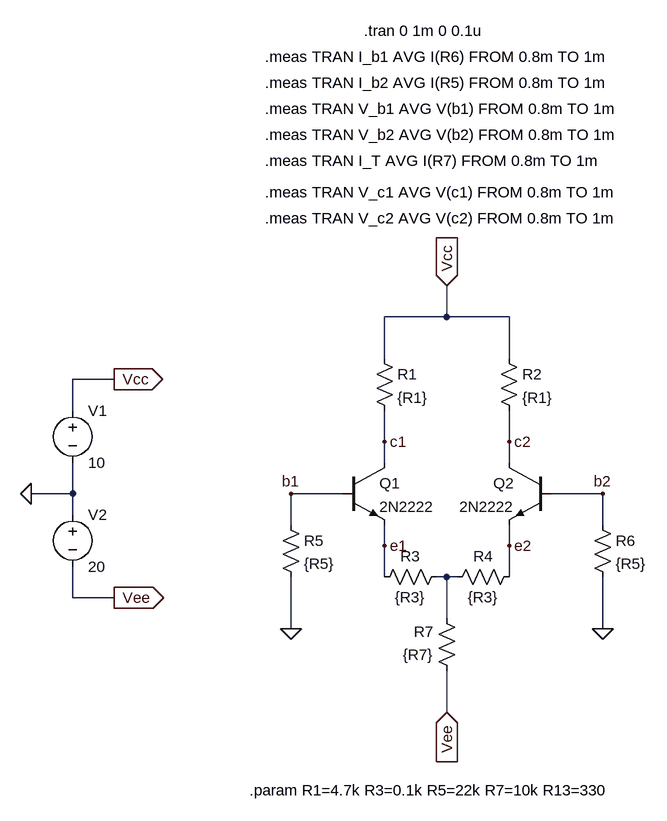
[diagram p0: schematic differential.asc]
differential.asc, the LTspice schematic file:
Version 4
SHEET 1 1232 680
WIRE 96 -128 96 -176
WIRE 96 -128 0 -128
WIRE 192 -128 96 -128
WIRE 0 -64 0 -128
WIRE 192 -64 192 -128
WIRE -416 -32 -480 -32
WIRE -480 16 -480 -32
WIRE 0 64 0 16
WIRE 192 64 192 16
WIRE 0 96 0 64
WIRE 192 96 192 64
WIRE -480 144 -480 96
WIRE -480 144 -544 144
WIRE -64 144 -144 144
WIRE 336 144 256 144
WIRE -480 176 -480 144
WIRE -144 192 -144 144
WIRE 336 192 336 144
WIRE 0 224 0 192
WIRE 192 224 192 192
WIRE 0 272 0 224
WIRE 96 272 80 272
WIRE 112 272 96 272
WIRE 192 272 192 224
WIRE -480 304 -480 256
WIRE -416 304 -480 304
WIRE 96 336 96 272
WIRE -144 352 -144 272
WIRE 336 352 336 272
WIRE 96 480 96 416
FLAG -544 144 0
FLAG -416 304 Vee
IOPIN -416 304 Out
FLAG -416 -32 Vcc
IOPIN -416 -32 Out
FLAG 96 -176 Vcc
IOPIN 96 -176 In
FLAG 96 480 Vee
IOPIN 96 480 In
FLAG 336 352 0
FLAG -144 352 0
FLAG 0 64 c1
FLAG 192 64 c2
FLAG 0 224 e1
FLAG 192 224 e2
FLAG -144 144 b1
FLAG 336 144 b2
SYMBOL npn -64 96 R0
SYMATTR InstName Q1
SYMATTR Value 2N2222
SYMBOL npn 256 96 M0
SYMATTR InstName Q2
SYMATTR Value 2N2222
SYMBOL res -16 -80 R0
SYMATTR InstName R1
SYMATTR Value {R1}
SYMBOL res 176 -80 R0
SYMATTR InstName R2
SYMATTR Value {R1}
SYMBOL res 96 256 R90
WINDOW 0 0 56 VBottom 2
WINDOW 3 32 56 VTop 2
SYMATTR InstName R3
SYMATTR Value {R3}
SYMBOL res 208 256 R90
WINDOW 0 0 56 VBottom 2
WINDOW 3 32 56 VTop 2
SYMATTR InstName R4
SYMATTR Value {R3}
SYMBOL res 112 432 R180
WINDOW 0 36 76 Left 2
WINDOW 3 36 40 Left 2
SYMATTR InstName R7
SYMATTR Value {R7}
SYMBOL voltage -480 0 R0
WINDOW 123 0 0 Left 0
WINDOW 39 0 0 Left 0
SYMATTR InstName V1
SYMATTR Value 10
SYMBOL voltage -480 160 R0
WINDOW 123 0 0 Left 0
WINDOW 39 0 0 Left 0
SYMATTR InstName V2
SYMATTR Value 20
SYMBOL res -160 176 R0
SYMATTR InstName R5
SYMATTR Value {R5}
SYMBOL res 320 176 R0
SYMATTR InstName R6
SYMATTR Value {R5}
TEXT -208 600 Left 2 !.param R1=4.7k R3=0.1k R5=22k R7=10k R13=330
TEXT -32 -568 Left 2 !.tran 0 1m 0 0.1u
TEXT -184 -528 Left 2 !.meas TRAN I_b1 AVG I(R6) FROM 0.8m TO 1m
TEXT -184 -488 Left 2 !.meas TRAN I_b2 AVG I(R5) FROM 0.8m TO 1m
TEXT -184 -448 Left 2 !.meas TRAN V_b1 AVG V(b1) FROM 0.8m TO 1m
TEXT -184 -408 Left 2 !.meas TRAN V_b2 AVG V(b2) FROM 0.8m TO 1m
TEXT -184 -368 Left 2 !.meas TRAN I_T AVG I(R7) FROM 0.8m TO 1m
TEXT -184 -320 Left 2 !.meas TRAN V_c1 AVG V(c1) FROM 0.8m TO 1m
TEXT -184 -280 Left 2 !.meas TRAN V_c2 AVG V(c2) FROM 0.8m TO 1m

The netlist it stands for:
* differential.asc
Q1 c1 b1 e1 0 2N2222
Q2 c2 b2 e2 0 2N2222
R1 Vcc c1 {R1}
R2 Vcc c2 {R1}
R3 N001 e1 {R3}
R4 e2 N001 {R3}
R7 Vee N001 {R7}
V1 Vcc 0 10
V2 0 Vee 20
R5 b1 0 {R5}
R6 b2 0 {R5}
.model NPN NPN
.model PNP PNP
.lib standard.bjt
.param R1=4.7k R3=0.1k R5=22k R7=10k R13=330
.tran 0 1m 0 0.1u
.meas TRAN I_b1 AVG I(R6) FROM 0.8m TO 1m
.meas TRAN I_b2 AVG I(R5) FROM 0.8m TO 1m
.meas TRAN V_b1 AVG V(b1) FROM 0.8m TO 1m
.meas TRAN V_b2 AVG V(b2) FROM 0.8m TO 1m
.meas TRAN I_T AVG I(R7) FROM 0.8m TO 1m
.meas TRAN V_c1 AVG V(c1) FROM 0.8m TO 1m
.meas TRAN V_c2 AVG V(c2) FROM 0.8m TO 1m
.backanno
.end